# Altium schematic sheet socket_power_supply.SchDoc: APTOMAT - Power Supply
size A3; Revision: 1.1.1; SheetNumber: 5; SheetTotal: 5; DrawnBy: KJP; ProjectNumber: 4397; PCBRevision: 0071KJP; DocumentSize: A4; PCAName: PCA10040; PCBNumber: 400150; ProjectName: Quark
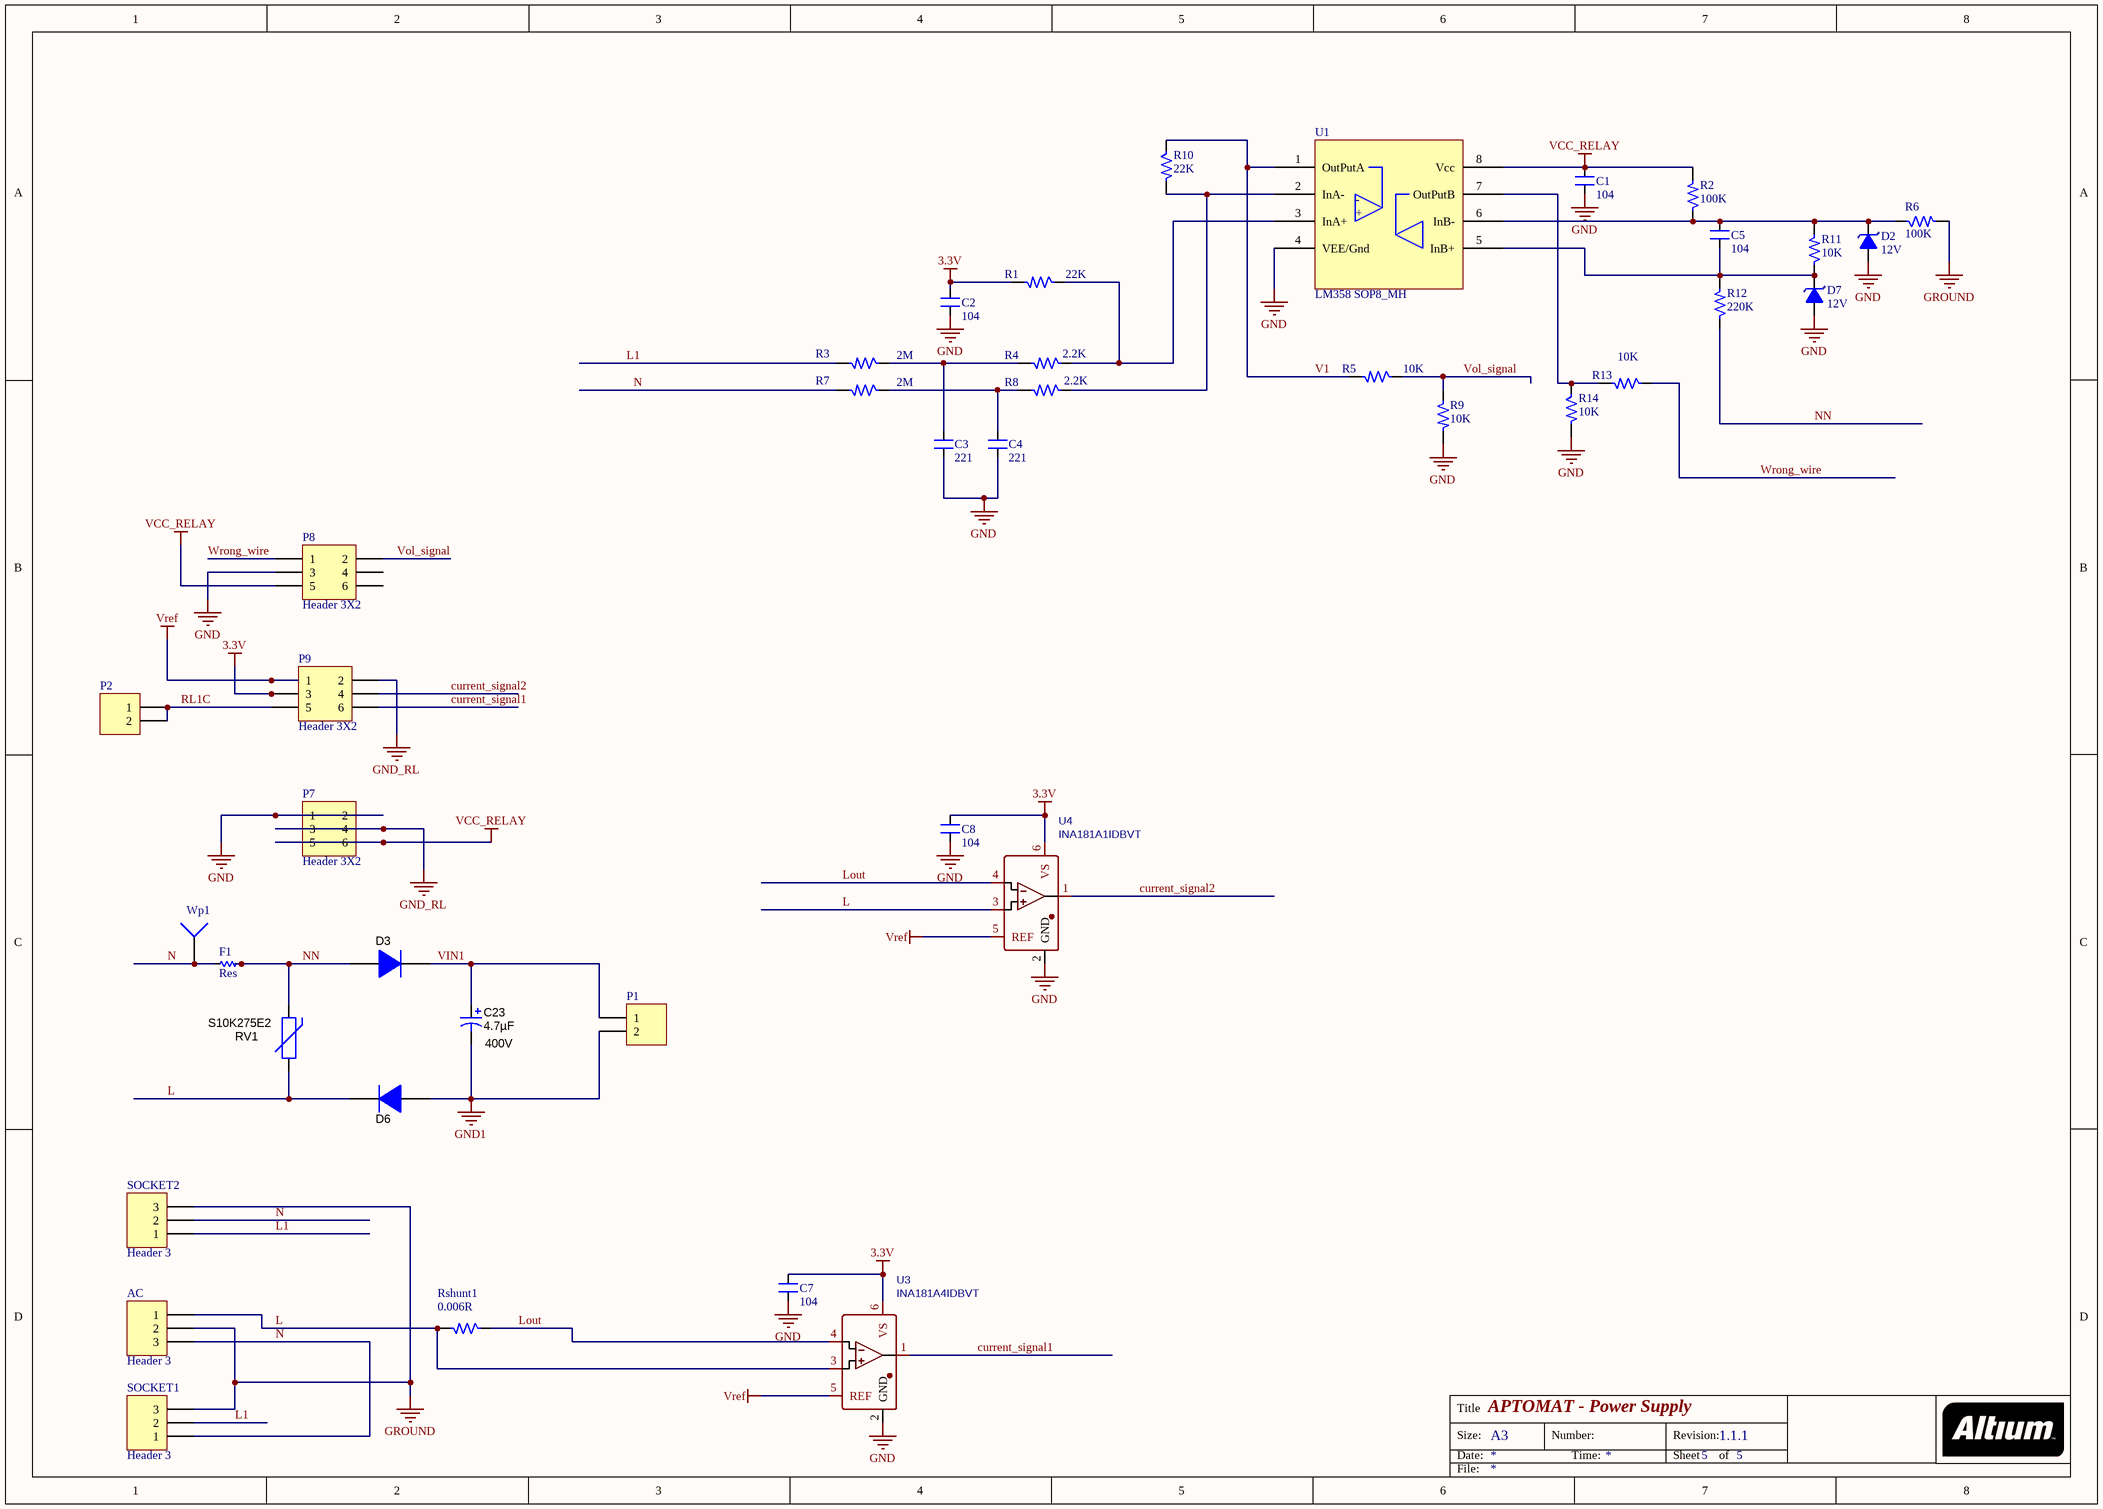
[diagram p0: socket_power_supply.SchDoc]

## Parts
AC  Header 3  [CHAN3DONGTO]
C1  104  [0805_HV]
C2  104  [0805_HV]
C3  221  [0805_HV]
C4  221  [0805_HV]
C5  104  [0805_HV]
C7  104  [0805_HV]
C8  104  [0805_HV]
C23  ValueDisplayed: 4.7µF  Value2: 400V  [PANACAP-G-GENERIC]  (hidden comment: 400AX6R8M8x11)
D2  12V  [Diode Zener 1N5359B 5W 24V]
D3  US1M-13-F  [SMB]  (value not drawn)
D6  US1M-13-F  [SMB]  (value not drawn)
D7  12V  [Diode Zener 1N5359B 5W 24V]
F1  Res  [1206]
P1  Header 2  [HDR1X2]  (value not drawn)
P2  Header 2  [HDR1X2]  (value not drawn)
P7  Header 3X2  [HDR2X3]
P8  Header 3X2  [HDR2X3]
P9  Header 3X2  [HDR2X3]
R1  22K  [0805_HV]
R2  100K  [0805_HV]
R3  2M  [1206]
R4  2.2K  [0805_HV]
R5  10K  [0805_HV]
R6  100K  [0805_HV]
R7  2M  [1206]
R8  2.2K  [0805_HV]
R9  10K  [0805_HV]
R10  22K  [0805_HV]
R11  10K  [0805_HV]
R12  220K  [0805_HV]
R13  10K  [0805_HV]
R14  10K  [0805_HV]
Rshunt1  0.006R  [RESC2728]
RV1  S10K275E2  [VAR_S10K275E2]
SOCKET1  Header 3  [socket]
SOCKET2  Header 3  [socket]
U1  LM358 SOP8_MH  [SOP 8]
U3  INA181A4IDBVT  [SOT95P280X145-6N]
U4  INA181A1IDBVT  [SOT95P280X145-6N]
Wp1  Socket  [PIN1]  (value not drawn)

## Nets
3.3V: C2.2 C7.2 C8.2 P9.3 R1.2 U3.6(VS) U4.6(VS)
GND: C1.1 C2.1 C3.1 C4.1 C7.1 C8.1 D2.1(A) D7.1(A) P7.1 P7.2 P8.3 R9.2 R14.2 U1.4(VEE/Gnd) U3.2(GND) U4.2(GND)
GND1: C23.2(-) D6.2(A) P1.2
GND_RL: P7.3 P7.4 P9.2
GROUND: AC.2 R6.2 SOCKET1.3 SOCKET2.3
VCC_RELAY: C1.2 P7.5 P7.6 P8.5 R2.2 U1.8(Vcc)
Vref: P9.1 U3.5(REF) U4.5(REF)
current_signal1: P9.6 U3.1(OUT)
current_signal2: P9.4 U4.1(OUT)
L: AC.1 D6.1(K) Rshunt1.2 RV1.1 U3.3(IN+) U4.3(IN+)
L1: R3.2 SOCKET1.2 SOCKET2.1
Lout: Rshunt1.1 U3.4(IN-) U4.4(IN-)
N: AC.3 F1.2 R7.2 SOCKET1.1 SOCKET2.2 Wp1.1
NN: D3.2(A) F1.1 R12.1 RV1.2
RL1C: P2.1 P2.2 P9.5
V1: R5.2 R10.1 U1.1(OutPutA)
VIN1: C23.1(+) D3.1(K) P1.1
Vol_signal: P8.2 R5.1 R9.1
Wrong_wire: P8.1 R13.1
NetC3_2: C3.2 R3.1 R4.2
NetC4_2: C4.2 R7.1 R8.2
NetC5_1: C5.1 D7.2(K) R11.1 R12.2 U1.5(InB+)
NetC5_2: C5.2 D2.2(K) R2.1 R6.1 R11.2 U1.6(InB-)
NetR1_1: R1.1 R4.1 U1.3(InA+)
NetR8_1: R8.1 R10.2 U1.2(InA-)
NetR13_2: R13.2 R14.1 U1.7(OutPutB)

Not connected (* = marked no-connect by the designer): P8 4 6

## Notes on the sheet
- Title
- Size:
- Date:
- A3
- Number:
- Time:
- Revision:
- Sheet
- of
- File:
- (in symbol LM358 SOP8_MH) -; +

## Library data of the parts
AC SOCKET1 SOCKET2 = Header 3: Header, 3-Pin; LatestRevisionDate: 17-Jul-2002; LatestRevisionNote: Re-released for DXP Platform.; Publisher: Altium Limited
C1-C5 C7 C8 = CM: Cap SMD; Value: 103
C23 = 400AX6R8M8x11: CAP, AL, 6.8uF, 400V, +/-20%, TH; Manufacturer: Rubycon; Polarized: Y; CompType: Capacitor; U/M: EA; Cap_F: 0.0000068; Tolerance_%: 20; Value1: Unknown; VDC_V: 400; TaMin_C: -40; TaMax_C: 105; Cap_Case: 8x11; SymbolVersion: 2008-07-09; Value: 6.8uF; PartNumber: 400AX6R8M8x11; PackageReference: 8x11; RoHS: Y; MountType: TH; Technology: AL; Series: AX; Publisher: Texas Instruments; LatestRevisionDate: 2013-08-02; ComponentLink1Description: Datasheet link; ComponentLink1URL: http://www.rubycon.co.jp/de/catalog/e_pdfs/aluminum/e_ax.pdf
D2 D7 = Diode Zenner 1W 13V 1N4743 DIP_MH: Diode Zenner 1W 13V 1N4743 DIP
D3 D6 = MURS160-13-F: Diode, Ultrafast, 600V, 1A, SMB; Manufacturer: Diodes Inc.; U/M: EA; Vf_V: 1.25; Value2: 1.25V; Io_A: 1; Vr_V: 600; TJmax_C: 150; RJC_CperW: 13; PartNumber: US1M-13-F; CompType: Diode; SymbolVersion: 2008-12-08; MountType: SMT; RoHS: Y; Value: 600V; PackageReference: SMB; Value1: 1A; Type: Ultrafast; Published: 2008-06-26; Publisher: Texas Instruments; LatestRevisionDate: 2013-06-21; ComponentLink1Description: Datasheet link; ComponentLink1URL: http://www.diodes.com/datasheets/ds30130.pdf; Supplier 1: Digi-Key; Supplier 2: Mouser; Supplier 3: Farnell
F1 = Res-SMD: Resistor; Manufacturer: Generic Components; Class: Passive; Published: 08/06/2000; Publisher: Altium Hobart Technology Centre
P1 P2 = Header 2: Header, 2-Pin; LatestRevisionDate: 17-Jul-2002; LatestRevisionNote: Re-released for DXP Platform.; Publisher: Altium Limited
P7-P9 = Header 3X2: Header, 3-Pin, Dual row; LatestRevisionDate: 17-Jul-2002; LatestRevisionNote: Re-released for DXP Platform.; Publisher: Altium Limited
R1-R14 Rshunt1 = R: Resistor 1/4W; Value: R1/4W - 1K
RV1 = S10K275E2: Varistor 275V RMS 10MM Radial, TH; Manufacturer: EPCOS Inc; SymbolCreator: a0412235; SymbolVersion: 2012-06-04; PartNumber: S10K275E2; MountType: TH; ComponentLink1Description: Datasheet URL; ComponentLink1URL: http://www.epcos.com/inf/70/db/var_08/SIOV_Leaded_AdvanceD.pdf; RoHS: Y; PackageReference: 10mm Radial; Publisher: Texas Instruments; LatestRevisionDate: 2013-02-24; Supplier 1: Digi-Key; Supplier Part Number 1: 495-1433-ND
U3 U4 = INA181: BOM_Manufacturer: Texas Instruments; BOM_Manufacturer Part: INA181A2IDBVT; Contributor: LCSC; BOM_Supplier: LCSC; BOM_Supplier Part: C116200; spicePre: U
Wp1 = Socket: LatestRevisionDate: 17-Jul-2002; LatestRevisionNote: Re-released for DXP Platform.; Publisher: Altium Limited